# EAGLE design mkboard_r1 (EAGLE 5.11)
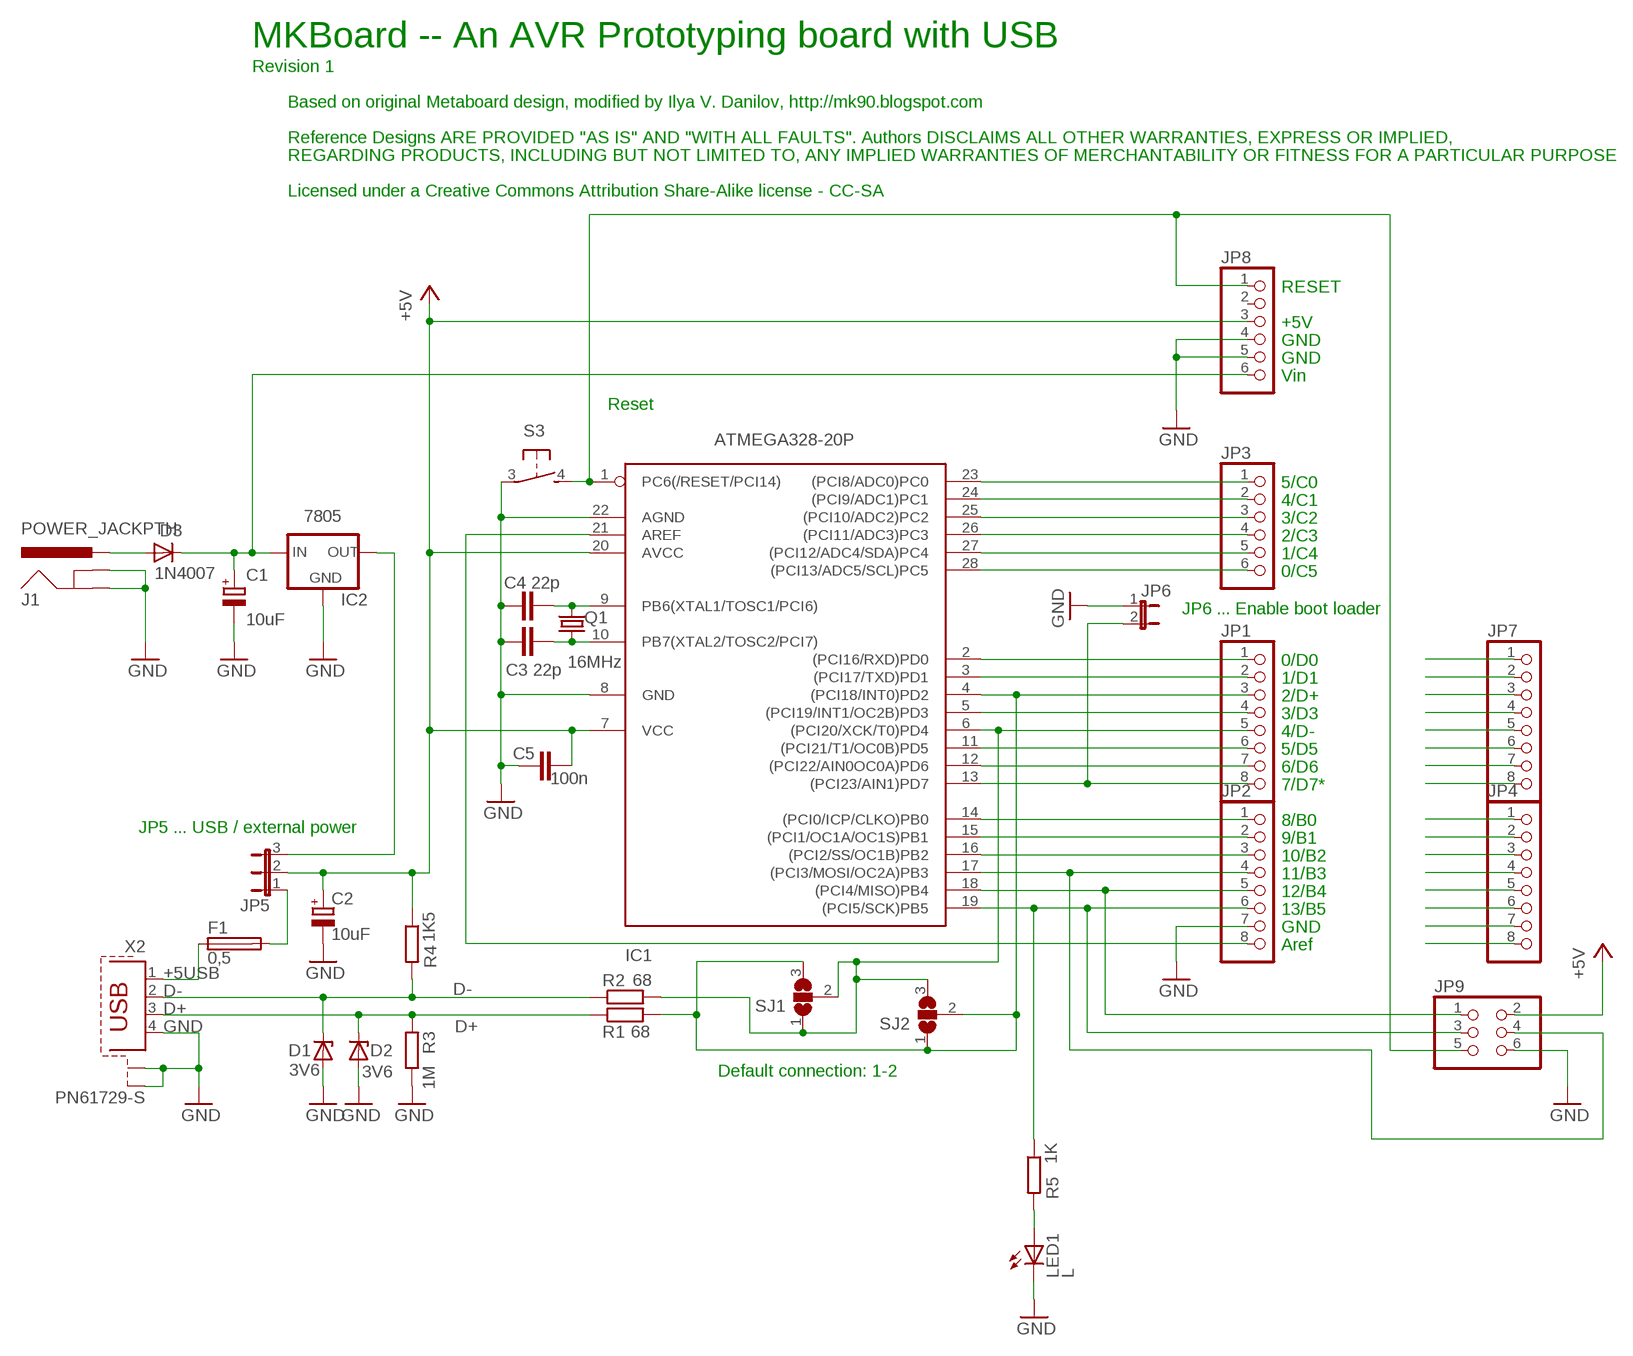
[diagram p0: schematic, sheet 1]

## Parts
C1  10uF  CPOL-EUE2,5-6E  [E2,5-6E]
C2  10uF  CPOL-EUE2,5-6E  [E2,5-6E]
C3  22p  C-EU050-025X075  [C050-025X075]
C4  22p  C-EU050-025X075  [C050-025X075]
C5  100n  C-EU050-025X075  [C050-025X075]
D1  3V6  ZENER-DIODEDO34-7  [DO34Z7]
D2  3V6  ZENER-DIODEDO34-7  [DO34Z7]
D3  1N4007  1N4004  [DO41-10]
F1  0,5  TE5  [TE5]
IC1  ATMEGA328-20P  ATMEGA168-20P  [DIL28-3]
IC2  7805  78XXL  [78XXL]
J1  POWER_JACKPTH  [POWER_JACK_PTH]
JP1  PINHD-1X8  [1X08]
JP2  PINHD-1X8  [1X08]
JP3  PINHD-1X6  [1X06]
JP4  PINHD-1X8  [1X08]
JP5  JP2E  [JP2]
JP6  JP1E  [JP1]
JP7  PINHD-1X8  [1X08]
JP8  PINHD-1X6  [1X06]
JP9  PINHD-2X3  [2X03]
LED1  L  LED3MM  [LED3MM]
Q1  16MHz  CRYSTALHC49S  [HC49/S]
R1  68  R-EU_0207/10  [0207/10]
R2  68  R-EU_0207/10  [0207/10]
R3  1M  R-EU_0207/10  [0207/10]
R4  1K5  R-EU_0207/10  [0207/10]
R5  1K  R-EU_0207/10  [0207/10]
S3  31-XX  [B3F-31XX]
SJ1  SJ2W  [SJ_2]
SJ2  SJ2W  [SJ_2]
X2  PN61729-S  [PN61729-S]

## Nets
+5USB: F1.1 X2.1
+5V: C2.+ C5.2 IC1.7(VCC) IC1.20(AVCC) JP5.2 JP8.3 JP9.2 R4.1
+VIN: C1.+ D3.C IC2.IN JP8.6
AREF: IC1.21(AREF) JP2.8 JP4.8
B0: IC1.14((PCI0/ICP/CLKO)PB0) JP2.1 JP4.1
B1: IC1.15((PCI1/OC1A/OC1S)PB1) JP2.2 JP4.2
B2: IC1.16((PCI2/SS/OC1B)PB2) JP2.3 JP4.3
B3: IC1.17((PCI3/MOSI/OC2A)PB3) JP2.4 JP4.4 JP9.4
B4: IC1.18((PCI4/MISO)PB4) JP2.5 JP4.5 JP9.1
B5: IC1.19((PCI5/SCK)PB5) JP2.6 JP4.6 JP9.3 R5.1
C0: IC1.23((PCI8/ADC0)PC0) JP3.1
C1: IC1.24((PCI9/ADC1)PC1) JP3.2
C2: IC1.25((PCI10/ADC2)PC2) JP3.3
C3: IC1.26((PCI11/ADC3)PC3) JP3.4
C4: IC1.27((PCI12/ADC4/SDA)PC4) JP3.5
C5: IC1.28((PCI13/ADC5/SCL)PC5) JP3.6
D0: IC1.2((PCI16/RXD)PD0) JP1.1 JP7.1
D1: IC1.3((PCI17/TXD)PD1) JP1.2 JP7.2
D2: IC1.4((PCI18/INT0)PD2) JP1.3 JP7.3 R1.2 SJ1.3 SJ2.1 SJ2.2
D3: IC1.5((PCI19/INT1/OC2B)PD3) JP1.4 JP7.4
D4: IC1.6((PCI20/XCK/T0)PD4) JP1.5 JP7.5 R2.2 SJ1.1 SJ1.2 SJ2.3
D5: IC1.11((PCI21/T1/OC0B)PD5) JP1.6 JP7.6
D6: IC1.12((PCI22/AIN0OC0A)PD6) JP1.7 JP7.7
D7: IC1.13((PCI23/AIN1)PD7) JP1.8 JP6.2 JP7.8
D+: D2.C R1.1 R3.2 X2.3
D-: D1.C R2.1 R4.2 X2.2
GND: C1.- C2.- C3.1 C4.1 C5.1 D1.A D2.A IC1.8(GND) IC1.22(AGND) IC2.GND J1.GND J1.GNDBREAK JP2.7 JP4.7 JP6.1 JP8.4 JP8.5 JP9.6 LED1.K(C) R3.1 S3.3(P) X2.4 X2.S1 X2.S2
N$1: LED1.A R5.2
N$4: D3.A J1.PWR
N$8: IC2.OUT JP5.3
N$9: C3.2 IC1.10(PB7(XTAL2/TOSC2/PCI7)) Q1.1
N$10: C4.2 IC1.9(PB6(XTAL1/TOSC1/PCI6)) Q1.2
N$130: F1.2 JP5.1
RESET: IC1.1(PC6(/RESET/PCI14)) JP8.1 JP9.5 S3.4(S)
Unconnected: JP8.2

## Notes on the sheet
- MKBoard -- An AVR Prototyping board with USB
- Revision 1
- Based on original Metaboard design, modified by Ilya V. Danilov, http://mk90.blogspot.com
- Reference Designs ARE PROVIDED "AS IS" AND "WITH ALL FAULTS". Authors DISCLAIMS ALL OTHER WARRANTIES, EXPRESS OR IMPLIED,
- REGARDING PRODUCTS, INCLUDING BUT NOT LIMITED TO, ANY IMPLIED WARRANTIES OF MERCHANTABILITY OR FITNESS FOR A PARTICULAR PURPOSE
- Licensed under a Creative Commons Attribution Share-Alike license - CC-SA
- RESET
- +5V
- GND
- GND
- Vin
- Reset
- 5/C0
- 4/C1
- 3/C2
- 2/C3
- 1/C4
- 0/C5
- JP6 ... Enable boot loader
- 0/D0
- 1/D1
- 2/D+
- 3/D3
- 4/D-
- 5/D5
- 6/D6
- 7/D7*
- 8/B0
- JP5 ... USB / external power
- 9/B1
- 10/B2
- 11/B3
- 12/B4
- 13/B5
- GND
- Aref
- Default connection: 1-2

## Library data of the parts
C1 C2 = rcl:CPOL-EU: POLARIZED CAPACITOR, European symbol
C3-C5 = resistor:C-EU: CAPACITOR, European symbol
D1 D2 = diode:ZENER-DIODE: Z-Diode
D3 = diode:1N4004: DIODE general purpose rectifier, 1 A
F1 = fuse:TE5: FUSE Wickmann; OC_FARNELL: unknown; OC_NEWARK: unknown
IC1 = avr:ATMEGA168*P: MICROCONTROLLER 16 kBytes FLASH 1 kBytes SRAM 512 Bytes EEPROM USART 8-channel 10 bit ADC
IC2 = v-reg:78XXL: VOLTAGE REGULATOR
J1 = SparkFun:POWER_JACK: Power Jack This is the standard 5.5mm barrel jack for power. The PTH is the most common, proven, reliable, footprint. All others are experimental. The Slot footprint only works if the mill layer is transmitted to the PCB fab house so be warned. Spark Fun Electronics SKU : PRT-00119. Mating wall wart : TOL-00298 (and others)
JP1 JP2 JP4 JP7 = pinhead:PINHD-1X8: PIN HEADER
JP3 JP8 = pinhead:PINHD-1X6: PIN HEADER
JP5 = jumper:JP2E: JUMPER
JP6 = jumper:JP1E: JUMPER
JP9 = pinhead:PINHD-2X3: PIN HEADER
LED1 = led:LED: LED OSRAM: - CHIPLED LG R971, LG N971, LY N971, LG Q971, LY Q971, LO R971, LY R971 LH N974, LH R974 LS Q976, LO Q976, LY Q976 LO Q996 - Hyper CHIPLED LW Q18S LB Q993, LB Q99A, LB R99A - SideLED LS A670, LO A670, LY A670, LG A670, LP A670 LB A673, LV A673, LT A673, LW A673 LH A674 LY A675 LS A676, LA A676, LO A676, LY A676, LW A676 LS A679, LY A679, LG A679 - Hyper Micro SIDELED® LS Y876, LA Y876, LO Y876, LY Y876 LT Y87S - SmartLED LW L88C, LW L88S LB L89C, LB L89S, LG L890 LS L89K, LO L89K, LY L89K LS L896, LA L896, LO L896, LY L896 - TOPLED LS T670, LO T670, LY T670, LG T670, LP T670 LSG T670, LSP T670, LSY T670, LOP T670, LYG T670 LG T671, LOG T671, LSG T671 LB T673, LV T673, LT T673, LW T673 LH T674 LS T676, LA T676, LO T676, LY T676, LB T676, LH T676, LSB T676, LW T676 LB T67C, LV T67C, LT T67C, LS T67K, LO T67K, LY T67K, LW E67C LS E67B, LA E67B, LO E67B, LY E67B, LB E67C, LV E67C, LT E67C LW T67C LS T679, LY T679, LG T679 LS T770, LO T770, LY T770, LG T770, LP T770 LB T773, LV T773, LT T773, LW T773 LH T774 LS E675, LA E675, LY E675, LS T675 LS T776, LA T776, LO T776, LY T776, LB T776 LHGB T686 LT T68C, LB T68C - Hyper Mini TOPLED® LB M676 - Mini TOPLED Santana® LG M470 LS M47K, LO M47K, LY M47K Source: http://www.osram.convergy.de LUXEON: - LUMILED® LXK2-PW12-R00, LXK2-PW12-S00, LXK2-PW14-U00, LXK2-PW14-V00 LXK2-PM12-R00, LXK2-PM12-S00, LXK2-PM14-U00 LXK2-PE12-Q00, LXK2-PE12-R00, LXK2-PE12-S00, LXK2-PE14-T00, LXK2-PE14-U00 LXK2-PB12-K00, LXK2-PB12-L00, LXK2-PB12-M00, LXK2-PB14-N00, LXK2-PB14-P00, LXK2-PB14-Q00 LXK2-PR12-L00, LXK2-PR12-M00, LXK2-PR14-Q00, LXK2-PR14-R00 LXK2-PD12-Q00, LXK2-PD12-R00, LXK2-PD12-S00 LXK2-PH12-R00, LXK2-PH12-S00 LXK2-PL12-P00, LXK2-PL12-Q00, LXK2-PL12-R00 Source: www.luxeon.com KINGBRIGHT: KA-3528ASYC Source: www.kingbright.com
Q1 = crystal:CRYSTAL: CRYSTAL; OC_FARNELL: 1667008; OC_NEWARK: unknown
R1-R4 = rcl:R-EU_: RESISTOR, European symbol
R5 = resistor:R-EU_: RESISTOR, European symbol
S3 = button-6x6x3:31-XX: OMRON SWITCH; MPN: B3F-3100; OC_FARNELL: 959704; OC_NEWARK: 36M3582
SJ1 SJ2 = jumper:SJ2W: SMD solder JUMPER
X2 = con-berg:PN61729-S: BERG USB connector; OC_FARNELL: unknown; OC_NEWARK: unknown

## Board
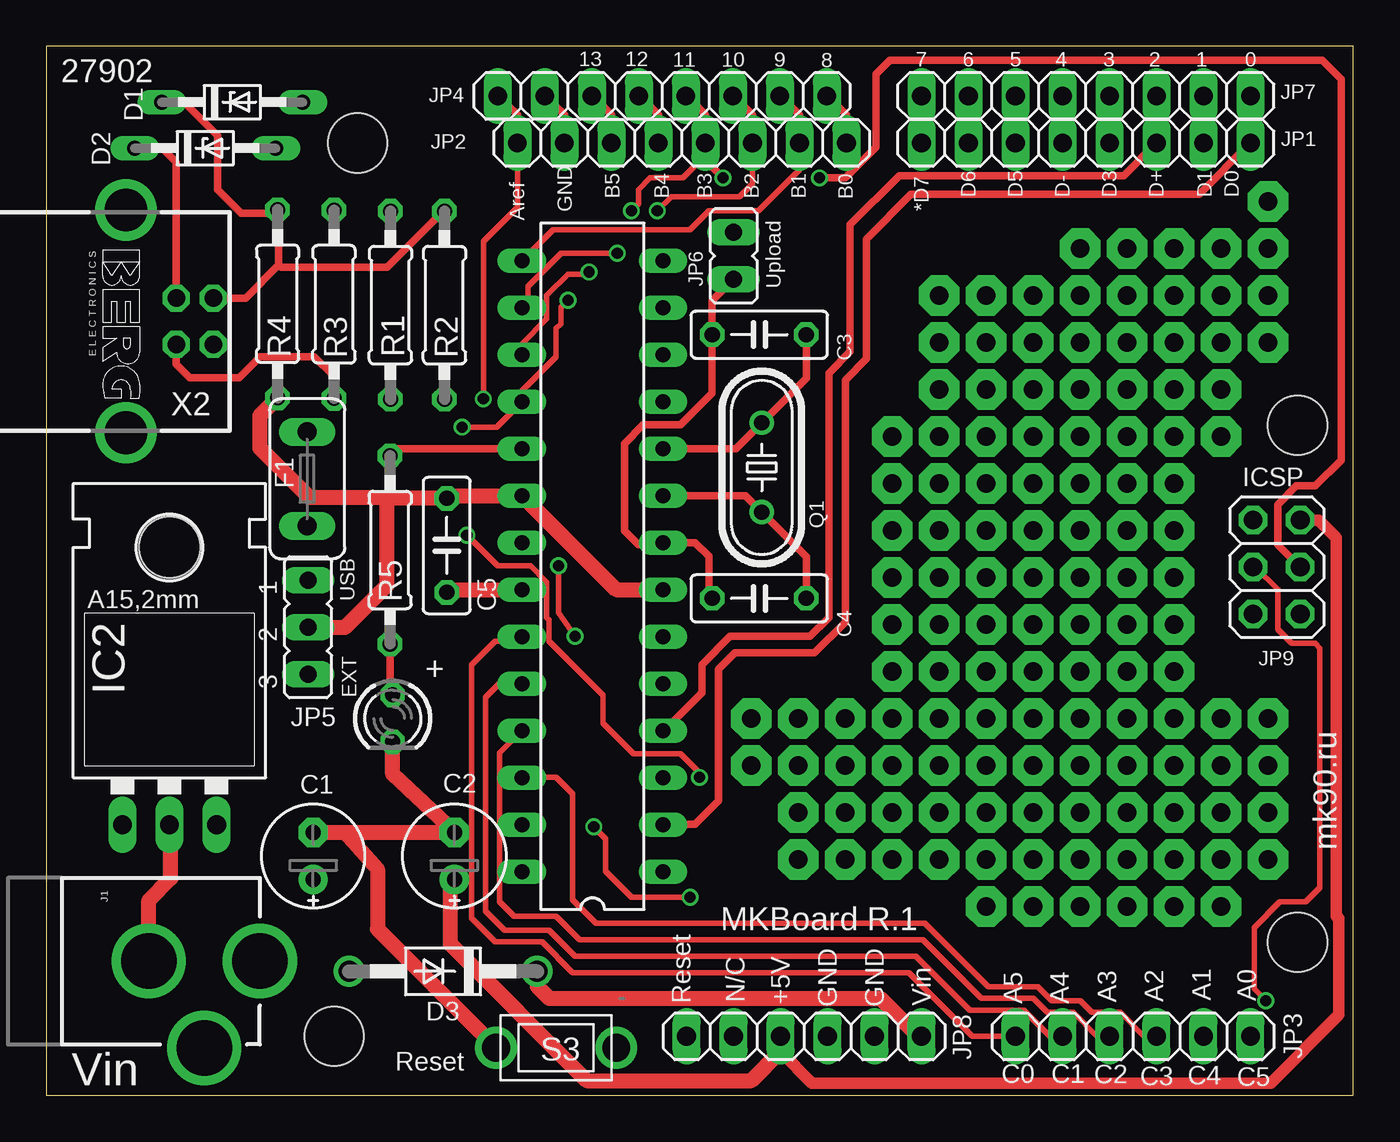
[diagram p1: board, top side]
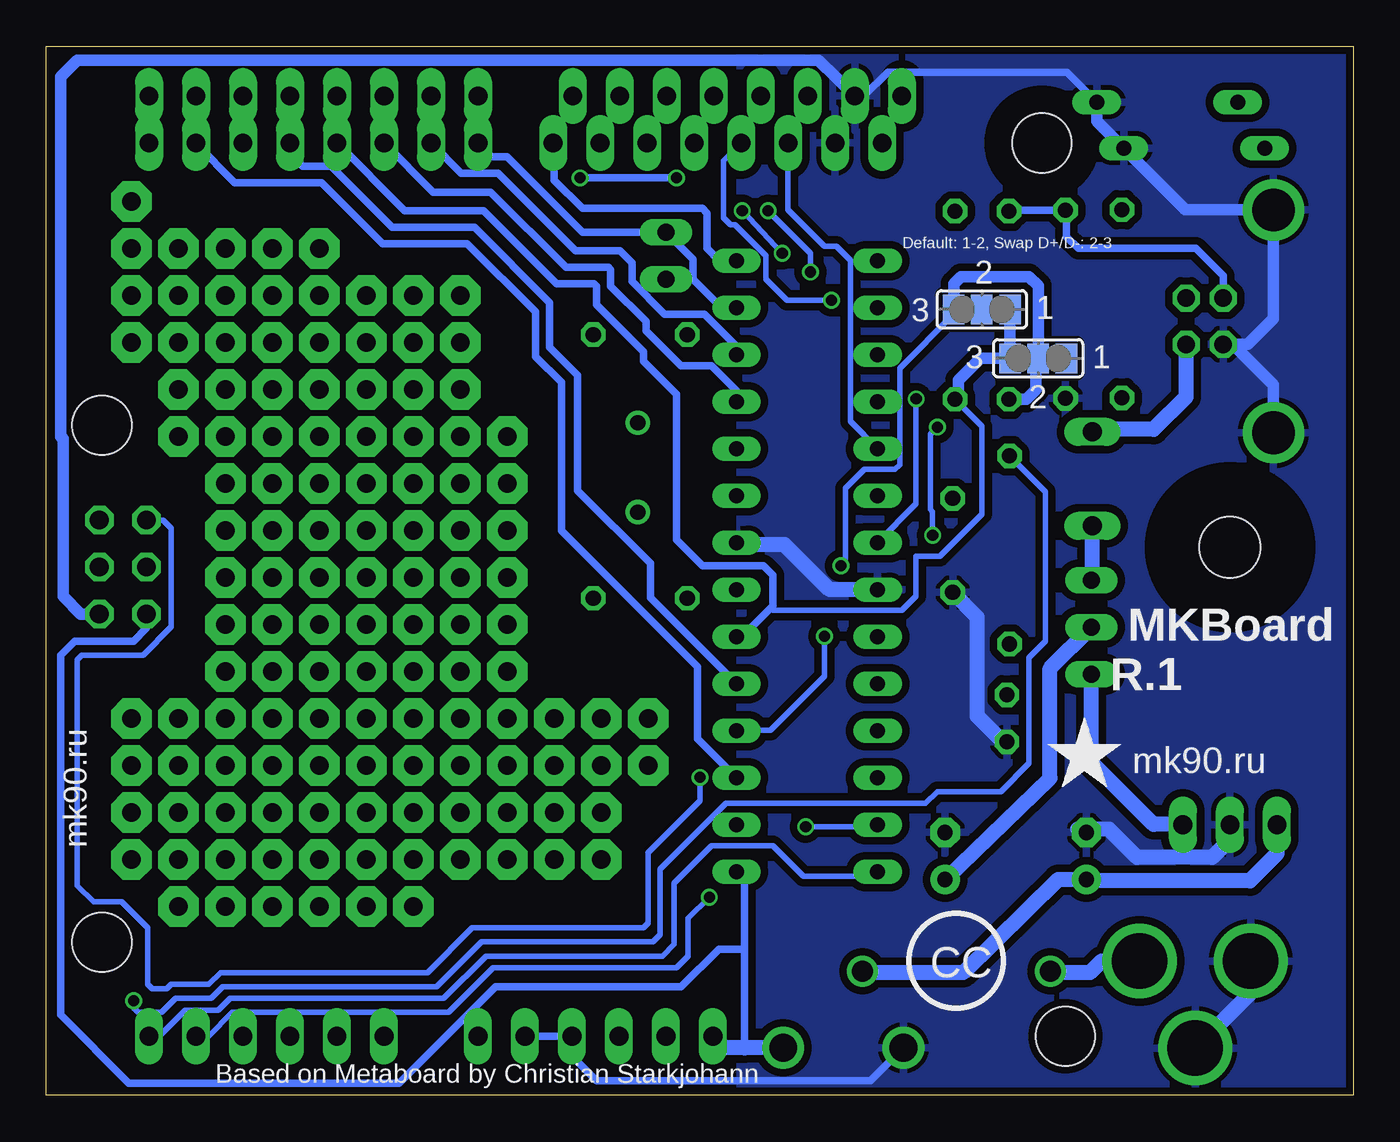
[diagram p2: board, bottom side, seen from below]

Size 70.63 x 56.65 mm. Coordinates in mm from the lower left corner, seen from the top.
Outline: 0,0 70.63,0 70.63,56.65 0,56.65 0,0
Copper layers (1*16): Top 0.035mm / dielectric 1.5mm / Bottom 0.035mm
Design rules "Fusion_eagle_rule_v1.1 *": minimum track width 6mil, minimum drill 12mil, track to track 6mil, track to pad 6mil, pad to pad 6mil, via to via 6mil, smd to smd 0mil, copper to edge 10mil, drill to drill 10mil, minimum pad ring 10mil, minimum via ring 6mil, stop-mask expansion 2mil, vias tented up to drill 100mil, thermal gap 10mil
Holes 3.2 mm at 67.62,36.19 67.62,8.25 16.82,51.43 15.55,3.17
bRestrict: area 14.1,48.7 to 19.5,54.1

### Footprints (pad centres in the part's own frame; a part is rotated, then mirrored left to right if it is on the bottom)
E2,5-6E = drill 0.813 pad 1.575 round: + -1.27,0 | drill 0.813 pad 1.575 octagon: - 1.27,0
C050-025X075 = drill 0.813 octagon: 1 -2.54,0; 2 2.54,0
DO34Z7 = drill 0.813 long: A 3.81,0; C -3.81,0
DO41-10 = drill 1.118 round: A 5.08,0; C -5.08,0
TE5 = drill 1.016 long: 1 -2.54,0; 2 2.54,0
DIL28-3 = drill 0.813 long: 1 -16.51,-3.81; 2 -13.97,-3.81; 3 -11.43,-3.81; 4 -8.89,-3.81; 5 -6.35,-3.81; 6 -3.81,-3.81; 7 -1.27,-3.81; 8 1.27,-3.81; 9 3.81,-3.81; 10 6.35,-3.81; 11 8.89,-3.81; 12 11.43,-3.81; 13 13.97,-3.81; 14 16.51,-3.81; 15 16.51,3.81; 16 13.97,3.81; 17 11.43,3.81; 18 8.89,3.81; 19 6.35,3.81; 20 3.81,3.81; 21 1.27,3.81; 22 -1.27,3.81; 23 -3.81,3.81; 24 -6.35,3.81; 25 -8.89,3.81; 26 -11.43,3.81; 27 -13.97,3.81; 28 -16.51,3.81
78XXL = drill 1.016 long: GND 0,-3.81; IN -2.54,-3.81; OUT 2.54,-3.81 | hole 3.302: 0,11.176
POWER_JACK_PTH = drill 2.997 round: GND 0,7.7; GNDBREAK 4.7,10.7; PWR 0,13.7
1X08 = drill 1.016 long: 1 -8.89,0; 2 -6.35,0; 3 -3.81,0; 4 -1.27,0; 5 1.27,0; 6 3.81,0; 7 6.35,0; 8 8.89,0
1X06 = drill 1.016 long: 1 -6.35,0; 2 -3.81,0; 3 -1.27,0; 4 1.27,0; 5 3.81,0; 6 6.35,0
JP2 = drill 0.914 long: 1 -2.54,0; 2 0,0; 3 2.54,0
JP1 = drill 0.914 long: 1 0,-1.27; 2 0,1.27
2X03 = drill 1.016 octagon: 1 -2.54,-1.27; 2 -2.54,1.27; 3 0,-1.27; 4 0,1.27; 5 2.54,-1.27; 6 2.54,1.27
LED3MM = drill 0.813 octagon: A -1.27,0; K 1.27,0
HC49/S = drill 0.813 round: 1 -2.413,0; 2 2.413,0
0207/10 = drill 0.813 octagon: 1 -5.08,0; 2 5.08,0
B3F-31XX = drill 1.5 pad 2.159 round: 3 -3.25,0; 4 3.25,0
SJ_2 = smd 1.168 x 1.6: 1 -1.524,0; 2 0,0; 3 1.524,0
PN61729-S = drill 0.95 octagon: 1 1.25,4.71; 2 -1.25,4.71; 3 -1.25,2.71; 4 1.25,2.71 | drill 2.3 pad 2.9 round: S1 -6.02,0; S2 6.02,0

### Placement (x,y rotation side)
C1  14.43,12.91 90 top
C2  22.06,12.91 90 top
C3  38.53,41.08 0 top
C4  38.53,26.83 0 top
C5  21.65,29.69 90 top
D1  10.05,53.64 0 top
D2  8.59,51.15 0 top
D3  21.44,6.68 180 top
F1  14.1,33.29 270 top
IC1  29.52,28.57 90 top
IC2  6.66,18.41 0 top
J1  -2.16,7.23 270 top
JP1  56.19,51.43 180 top
JP2  34.35,51.43 180 top
JP3  58.73,3.17 0 top
JP4  33.29,53.97 180 top
JP5  14.15,25.27 270 top
JP6  37.14,45.33 0 top
JP7  56.19,53.97 180 top
JP8  40.95,3.17 0 top
JP9  66.49,28.52 270 top
LED1  18.72,20.35 270 top
Q1  38.67,33.9 270 top
R1  18.6,42.67 270 top
R2  21.52,42.67 270 top
R3  15.55,42.72 90 top
R4  12.5,42.74 90 top
R5  18.58,29.44 270 top
S3  27.56,2.55 0 top
SJ1  20.07,42.44 180 bottom
SJ2  17.02,39.8 180 bottom
X2  4.32,41.8 270 top

### Tracks (layer width: path | path; a pad name or v marks a point on that pad's centre or on a via)
+5USB
  Bottom 0.813: X2.1 9.03,37.72 10.79,35.95 14.1,35.95 F1.1
+5V
  Top 0.406: 21.6,32.27 C5.2 21.8,32.38
  Top 0.61: JP9.2 68.77,31.06 69.72,30.11 69.72,9.66 69.85,9.54 69.85,4.33 66.17,0.65 41.39,0.65 39.68,2.36
  Top 0.813: 18.41,32.27 21.6,32.27 | 21.8,32.38 IC1.20 30.79,27.3 IC1.7 | 18.41,32.27 18.41,27.54 16.14,25.27 JP5.2 | JP8.3 39.68,2.36 38.1,0.77 29.21,0.77 21.84,8.14 21.84,11.65 C2.+ | R4.1 11.56,36.72 11.56,34.94 14.22,32.27 18.41,32.27
  Bottom 0.813: C2.+ 16.38,17.12 16.38,23.04 JP5.2
+VIN
  Top 0.813: JP8.6 47.13,3.17 45.08,5.22 27.18,5.22 26.54,5.85 26.54,6.67 D3.C
  Bottom 0.813: IC2.IN 4.12,13.03 5.59,11.57 14.65,11.57 C1.+ 15.96,11.64 21.08,6.62 26.46,6.62 D3.C
AREF  (via drill 0.6)
  Top 0.305: JP2.8 25.46,47.95 23.62,46.11 v23.62,37.6
  Top 0.406: JP4.8 25.46,52.95 JP2.8
  Bottom 0.305: v23.62,37.6 23.62,31.93 IC1.21
B0
  Top 0.406: JP4.1 43.24,52.95 JP2.1
  Bottom 0.406: IC1.14 34.27,45.08 34.92,45.73 34.92,47.64 35.18,47.89 41.65,47.89 43.18,49.42 43.18,51.37 JP2.1
B1
  Top 0.305: JP2.2 40.7,49.98 38.48,47.76 35.81,47.76 34.8,46.75 27.38,46.75 IC1.15
  Top 0.406: JP4.2 40.7,52.95 JP2.2
B2  (via drill 0.6)
  Top 0.305: JP2.3 38.16,49.22 37.46,48.53 33.78,48.53 v33.02,47.76 | v30.86,45.48 27.81,45.48 26.03,43.7 26.03,42.86 IC1.16
  Top 0.406: JP4.3 38.16,52.95 JP2.3
  Bottom 0.305: v30.86,45.48 v33.02,47.76
B3  (via drill 0.6)
  Top 0.305: IC1.17 25.71,40.58 27.05,41.92 27.05,43.19 28.19,44.34 29.21,44.34 v29.34,44.46 | JP2.4 35.56,51.37 35.56,50.69 34.42,49.54 32.64,49.54 32,48.91 32,48.15 v31.62,47.76
  Top 0.406: JP4.4 35.62,52.95 JP2.4 | 35.56,50.69 35.56,50.56 v36.57,49.54 | v41.78,49.54 43.18,49.54 44.83,51.19 44.83,55.13 45.59,55.89 68.96,55.89 69.98,54.88 69.98,34.3 68.58,32.91 67.56,32.91 66.55,31.89 66.55,29.74 JP9.4
  Bottom 0.305: v29.34,44.46 29.34,45.48 v31.62,47.76
  Bottom 0.406: v36.57,49.54 v41.78,49.54
B4  (via drill 0.6)
  Top 0.305: v28.19,42.94 27.81,42.56 27.81,41.67 27.56,41.41 27.56,39.89 25.71,38.04 IC1.18 24.33,36.08 v22.48,36.08 | v35.3,17.16 35.3,17.41 34.29,18.43 31.75,18.43 30.1,20.08 30.1,21.6 27.18,24.52 27.18,25.67 27.05,25.79 27.05,27.7 26.16,28.59 24.38,28.59 v22.73,30.24
  Top 0.406: JP4.5 33.08,52.95 JP2.5
  Bottom 0.305: v28.19,42.94 30.61,42.94 31.75,44.08 31.75,45.35 33.4,47 33.65,47 34.03,47.38 34.03,50.47 JP2.5 | JP9.1 64.32,31.06 63.88,30.62 63.88,25.29 65.4,23.76 68.71,23.76 68.96,23.51 68.96,11.32 68.07,10.43 66.55,10.43 65.15,9.03 65.15,5.98 64.9,5.73 64.13,5.73 63.88,5.98 61.85,5.98 61.21,6.62 50.04,6.62 47.62,9.03 38.35,9.03 38.1,9.28 38.1,13.09 35.3,15.89 v35.3,17.16 | v22.73,30.24 22.73,31.51 22.86,31.64 22.86,35.7 v22.48,36.08
B5  (via drill 0.6)
  Top 0.305: JP9.3 65.34,28.52 66.55,27.32 66.55,25.16 67.31,24.4 68.58,24.4 68.83,24.14 68.83,11.19 68.07,10.43 66.67,10.43 65.28,9.03 65.28,5.73 v65.91,5.09
  Top 0.406: JP4.6 30.54,52.95 JP2.6 | R5.1 18.97,34.92 IC1.19
  Bottom 0.305: JP2.6 30.54,47.82 28.57,45.86 27.94,45.86 27.18,45.1 27.18,36.38 IC1.19 | v65.91,5.09 65.91,4.71 65.66,4.46 64.39,4.46 63.63,5.22 61.72,5.22 61.09,5.85 49.53,5.85 47.12,8.27 37.84,8.27 37.46,8.65 37.46,12.2 33.91,15.76 23.11,15.76 22.48,16.4 19.05,16.4 17.52,17.92 17.52,23.63 16.64,24.52 16.64,32.58 R5.1
C0
  Top 0.305: JP3.1 50.05,3.17 46.61,6.62 28.45,6.62 26.8,8.27 24.26,8.27 22.99,9.54 22.99,23.25 24.26,24.52 25.48,24.52 IC1.23
C1
  Top 0.305: JP3.2 54.24,3.17 52.83,4.58 49.91,4.58 46.99,7.51 28.57,7.51 27.18,8.9 24.76,8.9 23.75,9.92 23.75,21.48 24.51,22.24 25.69,22.24 IC1.24
C2
  Top 0.305: JP3.3 56.78,3.17 55.5,4.46 54.1,4.46 53.34,5.22 50.54,5.22 47.37,8.39 28.83,8.39 27.56,9.66 25.27,9.66 24.51,10.43 24.51,18.48 IC1.25
C3
  Top 0.305: JP3.4 59.33,3.17 58.04,4.46 56.51,4.46 55.88,5.09 54.35,5.09 53.59,5.85 50.93,5.85 47.5,9.28 29.72,9.28 28.45,10.55 28.45,16.27 27.56,17.16 25.73,17.16 IC1.26
C4  (via drill 0.6)
  Top 0.305: v34.8,10.68 31.62,10.68 30.22,12.08 30.22,13.86 v29.59,14.49
  Bottom 0.305: JP3.5 61.87,3.17 60.58,4.46 48.89,4.46 46.48,6.87 36.57,6.87 35.94,7.51 35.94,9.54 v34.8,10.68 | v29.59,14.49 25.82,14.49 IC1.27
C5
  Bottom 0.305: JP3.6 64.53,3.17 63.12,4.58 61.34,4.58 60.7,5.22 49.15,5.22 46.86,7.51 37.34,7.51 36.7,8.14 36.7,11.44 34.67,13.47 31.37,13.47 29.72,11.82 25.95,11.82 IC1.28
D0
  Top 0.406: JP7.1 JP1.1 62.31,48.65 46.73,48.65 44.32,46.24 44.32,39.76 43.18,38.62 43.18,25.54 41.53,23.89 37.21,23.89 36.32,23 36.32,15.89 35.05,14.62 33.35,14.62 IC1.2
D1
  Top 0.406: JP1.2 JP7.2
  Bottom 0.406: IC1.3 35.43,19.24 35.43,23.13 42.8,30.49 42.8,38.49 44.19,39.89 44.19,42.3 47.88,45.99 52.45,45.99 55.75,49.29 60.45,49.29 62.54,51.38 JP1.2
D2  (via drill 0.6)
  Top 0.305: v28.57,24.78 27.68,26.05 v27.68,28.59
  Top 0.406: JP7.3 JP1.3 58.24,49.67 46.1,49.67 43.43,47 43.43,40.14 42.29,39 42.29,25.79 41.27,24.78 36.96,24.78 35.43,23.25 35.43,21.73 33.38,19.68 IC1.4
  Bottom 0.305: SJ1.3 21.6,42.17 24.51,39.26 24.51,34.05 24.76,33.79 26.41,33.79 27.43,32.78 27.43,28.97 v27.68,28.59 | v28.57,24.78 28.57,22.62 31.49,19.7 33.31,19.7 IC1.4
  Bottom 0.61: SJ2.2 SJ2.1 | R1.2 17.67,37.59 17.14,38.11 17.14,39.68 SJ2.2 | SJ2.2 17.02,43.71 17.52,44.21 21.21,44.21 21.59,43.83 SJ1.3
D3
  Top 0.406: JP1.4 JP7.4
  Bottom 0.406: IC1.5 37.97,26.86 37.97,28.71 41.91,32.65 41.91,38.87 43.43,40.4 43.43,42.81 47.5,46.88 51.94,46.88 55.24,50.18 56.77,50.18 57.46,50.87 JP1.4
D4
  Top 0.406: JP1.5 JP7.5
  Bottom 0.305: 31.49,26.3 31.37,26.17 24.38,26.17 23.62,26.94 23.62,29.1 22.35,29.1 20.06,31.38 20.06,36.13 R2.2
  Bottom 0.406: JP1.5 51.26,47.76 46.99,47.76 43.05,43.83 41.02,43.83 40.89,43.7 40.89,42.68 38.35,40.14 38.35,39.64 36.57,37.86 36.57,29.98 35.18,28.59 31.88,28.59 31.37,28.08 31.37,26.43 31.49,26.3 33.04,24.76 IC1.6
  Bottom 0.61: SJ1.2 SJ1.1 SJ2.3 20.16,39.8 21.33,38.62 21.33,37.77 R2.2
D5
  Top 0.406: JP1.6 JP7.6
  Bottom 0.406: IC1.11 33.33,38.04 34.67,39.38 36.32,39.38 38.23,41.29 38.23,41.8 40.13,43.7 40.13,44.59 40.26,44.72 42.54,44.72 46.61,48.78 49.73,48.78 JP1.6
D6
  Top 0.406: JP1.7 JP7.7
  Bottom 0.406: IC1.12 33.33,40.46 35.05,42.18 37.21,42.18 38.99,43.95 38.99,44.97 39.62,45.61 42.04,45.61 46.23,49.8 48.21,49.8 JP1.7
D7
  Top 0.406: JP1.8 JP7.8
  Bottom 0.406: IC1.13 34.14,42.54 35.69,44.08 35.69,45.15 JP6.2 41.64,46.6 45.72,50.69 46.56,50.69 JP1.8
D+
  Top 0.406: X2.3 7.03,50.39 6.22,51.19 4.82,51.19 D2.C
  Bottom 0.406: X2.3 7.03,44.25 8.51,45.73 14.86,45.73 15.49,46.37 15.49,47.74 R3.2 18.55,47.8 R1.1
D-
  Top 0.406: X2.2 10.77,43.05 12.57,44.84 | 12.57,44.84 12.57,47.76 R4.2 12.32,47.64 10.54,47.64 9.27,48.91 9.27,51.83 7.46,53.64 D1.C | R2.1 21.44,47.75 18.41,44.72 12.7,44.72 12.57,44.84
GND
  Top 0.406: JP2.7 28,52.95 JP4.7 | X2.4 7.03,39.47 7.75,38.75 10.41,38.75 11.56,39.89 14.48,39.89 15.49,38.87 15.49,37.7 R3.1 | C5.1 21.8,27.3 | C4.1 35.81,27.01 35.81,29.1 35.07,29.84 IC1.8 33.22,29.73 32,29.73 31.24,30.49 31.24,35.19 32.26,36.21 34.29,36.21 35.99,37.91 C3.1 35.99,42.91 JP6.1
  Top 0.813: J1.GND 5.54,10.51 6.73,11.7 6.73,14.53 IC2.GND | S3.3 17.91,8.95 17.91,12.2 16.13,14.18 | C1.- 16.13,14.18 | 16.13,14.18 C2.- 18.72,17.32 LED1.K | 21.8,27.3 IC1.22
  Bottom 0.406: JP4.7 26.43,53.97 25.14,55.26 15.48,55.26 D1.A | JP8.5 JP8.4 42.22,2.1 40.89,0.77 26.09,0.77 S3.3
  Bottom 0.61: D1.A 13.86,52.61 D2.A 9.07,47.82 X2.S1 4.32,41.92 5.69,40.55 X2.4 6.5,40.55 4.32,38.37 X2.S2 | JP9.6 68.76,25.98 69.72,26.94 69.72,35.45 69.85,35.57 69.85,55 68.96,55.89 28.9,55.89 JP4.7
  Bottom 0.813: J1.GND 5.54,5.53 J1.GNDBREAK | IC2.GND 6.66,13.8 7.62,12.84 11.68,12.84 13.21,14.36 14.91,14.36 C1.- | IC1.22 28.3,27.3 30.73,29.73 33.22,29.73 IC1.8 | LED1.K 18.93,19.08 20.32,20.46 20.32,25.82 C5.1
  pour Bottom (isolate 0.406): 0,56.65 33.15,56.65 33.15,0.01 0,0.01
N$1
  Top 0.406: R5.2 18.58,21.76 LED1.A
N$2  (via drill 1 pad 2.18)
  other vias: 45.72,33.03
N$3  (via drill 1 pad 2.18)
  other vias: 48.26,33.03
N$4
  Bottom 0.813: J1.PWR 13.61,7.23 14.22,6.62 16.3,6.62 D3.A
N$5  (via drill 1 pad 2.18)
  other vias: 50.8,33.03
N$6  (via drill 1 pad 2.18)
  other vias: 45.72,35.57
N$7  (via drill 1 pad 2.18)
  other vias: 48.26,35.57
N$8
  Bottom 0.813: IC2.OUT 9.22,14.62 10.79,14.62 14.15,17.98 JP5.3
N$9
  Top 0.406: IC1.10 37.27,34.92 Q1.1 41.07,38.72 C3.2
N$10
  Top 0.406: IC1.9 37.78,32.38 Q1.2 41.07,29.09 C4.2
N$11  (via drill 1 pad 2.18)
  other vias: 50.8,35.57
N$12  (via drill 1 pad 2.18)
  other vias: 45.72,27.95
N$13  (via drill 1 pad 2.18)
  other vias: 48.26,27.95
N$14  (via drill 1 pad 2.18)
  other vias: 50.8,27.95
N$15  (via drill 1 pad 2.18)
  other vias: 45.72,30.49
N$16  (via drill 1 pad 2.18)
  other vias: 48.26,30.49
N$17  (via drill 1 pad 2.18)
  other vias: 50.8,30.49
N$18  (via drill 1 pad 2.18)
  other vias: 45.72,25.41
N$19  (via drill 1 pad 2.18)
  other vias: 48.26,25.41
N$20  (via drill 1 pad 2.18)
  other vias: 50.8,25.41
N$21  (via drill 1 pad 2.18)
  other vias: 45.72,20.33
N$22  (via drill 1 pad 2.18)
  other vias: 48.26,20.33
N$23  (via drill 1 pad 2.18)
  other vias: 50.8,20.33
N$24  (via drill 1 pad 2.18)
  other vias: 45.72,22.87
N$25  (via drill 1 pad 2.18)
  other vias: 48.26,22.87
N$26  (via drill 1 pad 2.18)
  other vias: 50.8,22.87
N$27  (via drill 1 pad 2.18)
  other vias: 38.1,17.79
N$28  (via drill 1 pad 2.18)
  other vias: 40.64,17.79
N$29  (via drill 1 pad 2.18)
  other vias: 43.18,17.79
N$30  (via drill 1 pad 2.18)
  other vias: 38.1,20.33
N$31  (via drill 1 pad 2.18)
  other vias: 40.64,20.33
N$32  (via drill 1 pad 2.18)
  other vias: 43.18,20.33
N$33  (via drill 1 pad 2.18)
  other vias: 45.72,15.25
N$34  (via drill 1 pad 2.18)
  other vias: 48.26,15.25
N$35  (via drill 1 pad 2.18)
  other vias: 50.8,15.25
N$36  (via drill 1 pad 2.18)
  other vias: 45.72,17.79
N$37  (via drill 1 pad 2.18)
  other vias: 48.26,17.79
N$38  (via drill 1 pad 2.18)
  other vias: 50.8,17.79
N$39  (via drill 1 pad 2.18)
  other vias: 53.34,20.33
N$40  (via drill 1 pad 2.18)
  other vias: 55.88,20.33
N$41  (via drill 1 pad 2.18)
  other vias: 58.42,20.33
N$42  (via drill 1 pad 2.18)
  other vias: 53.34,22.87
N$43  (via drill 1 pad 2.18)
  other vias: 55.88,22.87
N$44  (via drill 1 pad 2.18)
  other vias: 58.42,22.87
N$45  (via drill 1 pad 2.18)
  other vias: 53.34,15.25
N$46  (via drill 1 pad 2.18)
  other vias: 55.88,15.25
N$47  (via drill 1 pad 2.18)
  other vias: 58.42,15.25
N$48  (via drill 1 pad 2.18)
  other vias: 53.34,17.79
N$49  (via drill 1 pad 2.18)
  other vias: 55.88,17.79
N$50  (via drill 1 pad 2.18)
  other vias: 58.42,17.79
N$51  (via drill 1 pad 2.18)
  other vias: 53.34,33.03
N$52  (via drill 1 pad 2.18)
  other vias: 55.88,33.03
N$53  (via drill 1 pad 2.18)
  other vias: 58.42,33.03
N$54  (via drill 1 pad 2.18)
  other vias: 53.34,35.57
N$55  (via drill 1 pad 2.18)
  other vias: 55.88,35.57
N$56  (via drill 1 pad 2.18)
  other vias: 58.42,35.57
N$57  (via drill 1 pad 2.18)
  other vias: 53.34,27.95
N$58  (via drill 1 pad 2.18)
  other vias: 55.88,27.95
N$59  (via drill 1 pad 2.18)
  other vias: 58.42,27.95
N$60  (via drill 1 pad 2.18)
  other vias: 53.34,30.49
N$61  (via drill 1 pad 2.18)
  other vias: 55.88,30.49
N$62  (via drill 1 pad 2.18)
  other vias: 58.42,30.49
N$63  (via drill 1 pad 2.18)
  other vias: 53.34,25.41
N$64  (via drill 1 pad 2.18)
  other vias: 55.88,25.41
N$65  (via drill 1 pad 2.18)
  other vias: 58.42,25.41
N$66  (via drill 1 pad 2.18)
  other vias: 60.96,20.33
N$67  (via drill 1 pad 2.18)
  other vias: 60.96,22.87
N$68  (via drill 1 pad 2.18)
  other vias: 60.96,15.25
N$69  (via drill 1 pad 2.18)
  other vias: 60.96,17.79
N$70  (via drill 1 pad 2.18)
  other vias: 60.96,33.03
N$71  (via drill 1 pad 2.18)
  other vias: 60.96,35.57
N$72  (via drill 1 pad 2.18)
  other vias: 60.96,27.95
N$73  (via drill 1 pad 2.18)
  other vias: 60.96,30.49
N$74  (via drill 1 pad 2.18)
  other vias: 60.96,25.41
N$75  (via drill 1 pad 2.18)
  other vias: 45.72,12.71
N$76  (via drill 1 pad 2.18)
  other vias: 48.26,12.71
N$77  (via drill 1 pad 2.18)
  other vias: 50.8,12.71
N$78  (via drill 1 pad 2.18)
  other vias: 53.34,12.71
N$79  (via drill 1 pad 2.18)
  other vias: 55.88,12.71
N$80  (via drill 1 pad 2.18)
  other vias: 58.42,12.71
N$81  (via drill 1 pad 2.18)
  other vias: 60.96,12.71
N$82  (via drill 1 pad 2.18)
  other vias: 40.64,15.25
N$83  (via drill 1 pad 2.18)
  other vias: 43.18,15.25
N$84  (via drill 1 pad 2.18)
  other vias: 63.5,20.33
N$85  (via drill 1 pad 2.18)
  other vias: 63.5,15.25
N$86  (via drill 1 pad 2.18)
  other vias: 63.5,17.79
N$87  (via drill 1 pad 2.18)
  other vias: 63.5,12.71
N$88  (via drill 1 pad 2.18)
  other vias: 50.8,10.17
N$89  (via drill 1 pad 2.18)
  other vias: 53.34,10.17
N$90  (via drill 1 pad 2.18)
  other vias: 55.88,10.17
N$91  (via drill 1 pad 2.18)
  other vias: 58.42,10.17
N$92  (via drill 1 pad 2.18)
  other vias: 60.96,10.17
N$93  (via drill 1 pad 2.18)
  other vias: 63.5,10.17
N$94  (via drill 1 pad 2.18)
  other vias: 43.18,12.71
N$95  (via drill 1 pad 2.18)
  other vias: 40.64,12.71
N$96  (via drill 1 pad 2.18)
  other vias: 66.04,20.33
N$97  (via drill 1 pad 2.18)
  other vias: 66.04,15.25
N$98  (via drill 1 pad 2.18)
  other vias: 66.04,17.79
N$99  (via drill 1 pad 2.18)
  other vias: 66.04,12.71
N$100  (via drill 1 pad 2.18)
  other vias: 48.26,38.11
N$101  (via drill 1 pad 2.18)
  other vias: 50.8,38.11
N$102  (via drill 1 pad 2.18)
  other vias: 53.34,38.11
N$103  (via drill 1 pad 2.18)
  other vias: 48.26,40.65
N$104  (via drill 1 pad 2.18)
  other vias: 50.8,40.65
N$105  (via drill 1 pad 2.18)
  other vias: 53.34,40.65
N$106  (via drill 1 pad 2.18)
  other vias: 55.88,38.11
N$107  (via drill 1 pad 2.18)
  other vias: 58.42,38.11
N$108  (via drill 1 pad 2.18)
  other vias: 60.96,38.11
N$109  (via drill 1 pad 2.18)
  other vias: 55.88,40.65
N$110  (via drill 1 pad 2.18)
  other vias: 58.42,40.65
N$111  (via drill 1 pad 2.18)
  other vias: 60.96,40.65
N$112  (via drill 1 pad 2.18)
  other vias: 63.5,38.11
N$113  (via drill 1 pad 2.18)
  other vias: 63.5,40.65
N$114  (via drill 1 pad 2.18)
  other vias: 48.26,43.19
N$115  (via drill 1 pad 2.18)
  other vias: 50.8,43.19
N$116  (via drill 1 pad 2.18)
  other vias: 53.34,43.19
N$117  (via drill 1 pad 2.18)
  other vias: 55.88,43.19
N$118  (via drill 1 pad 2.18)
  other vias: 58.42,43.19
N$119  (via drill 1 pad 2.18)
  other vias: 60.96,43.19
N$120  (via drill 1 pad 2.18)
  other vias: 63.5,43.19
N$121  (via drill 1 pad 2.18)
  other vias: 55.88,45.73
N$122  (via drill 1 pad 2.18)
  other vias: 58.42,45.73
N$123  (via drill 1 pad 2.18)
  other vias: 60.96,45.73
N$124  (via drill 1 pad 2.18)
  other vias: 63.5,45.73
N$125  (via drill 1 pad 2.18)
  other vias: 63.5,35.57
N$126  (via drill 1 pad 2.18)
  other vias: 66.04,40.65
N$127  (via drill 1 pad 2.18)
  other vias: 66.04,43.19
N$128  (via drill 1 pad 2.18)
  other vias: 66.04,45.73
N$129  (via drill 1 pad 2.18)
  other vias: 66.04,48.27
N$130
  Bottom 0.813: JP5.1 14.1,27.81 F1.2
RESET
  Bottom 0.406: IC1.1 32.89,11.62 32.89,7.89 | 32.89,2.55 32.89,7.89 | JP9.5 65.22,25.21 65.91,24.52 69.09,24.52 69.85,23.76 69.85,4.33 66.17,0.65 51.56,0.65 46.35,5.85 36.32,5.85 34.29,7.89 32.89,7.89
  Bottom 0.813: S3.4 32.89,2.55 33.98,2.55 JP8.1

### Text on the board
tPlace: 9 | 8 | 7 | 6 | 5 | 4 | 3 | 2 | 1 | 0 | 27902 | GND | B5 | B4 | B3 | B2 | B1 | B0 | *D7 | D6 | D5 | D- | D3 | D+ | D1 | D0 | Aref | Upload | mk90.ru | MKBoard R.1 | +5V | GND | GND | Vin | A5 | A4 | A3 | A2 | A1 | A0 | Vin | Reset | C4 | C0 | C1 | C2 | C5 | C3
bPlace: Default: 1-2, Swap D+/D-: 2-3 | 2 | 1 | 3 | 1 | 3 | 2 | MKBoard | R.1 | mk90.ru | mk90.ru | CC | Based on Metaboard by Christian Starkjohann
tNames: 13 | 12 | 11 | 10 | ICSP | USB | + | EXT | Reset | N/C